# EAGLE design Airbeam v2.4 12-21-2017 (EAGLE 8.4.1)
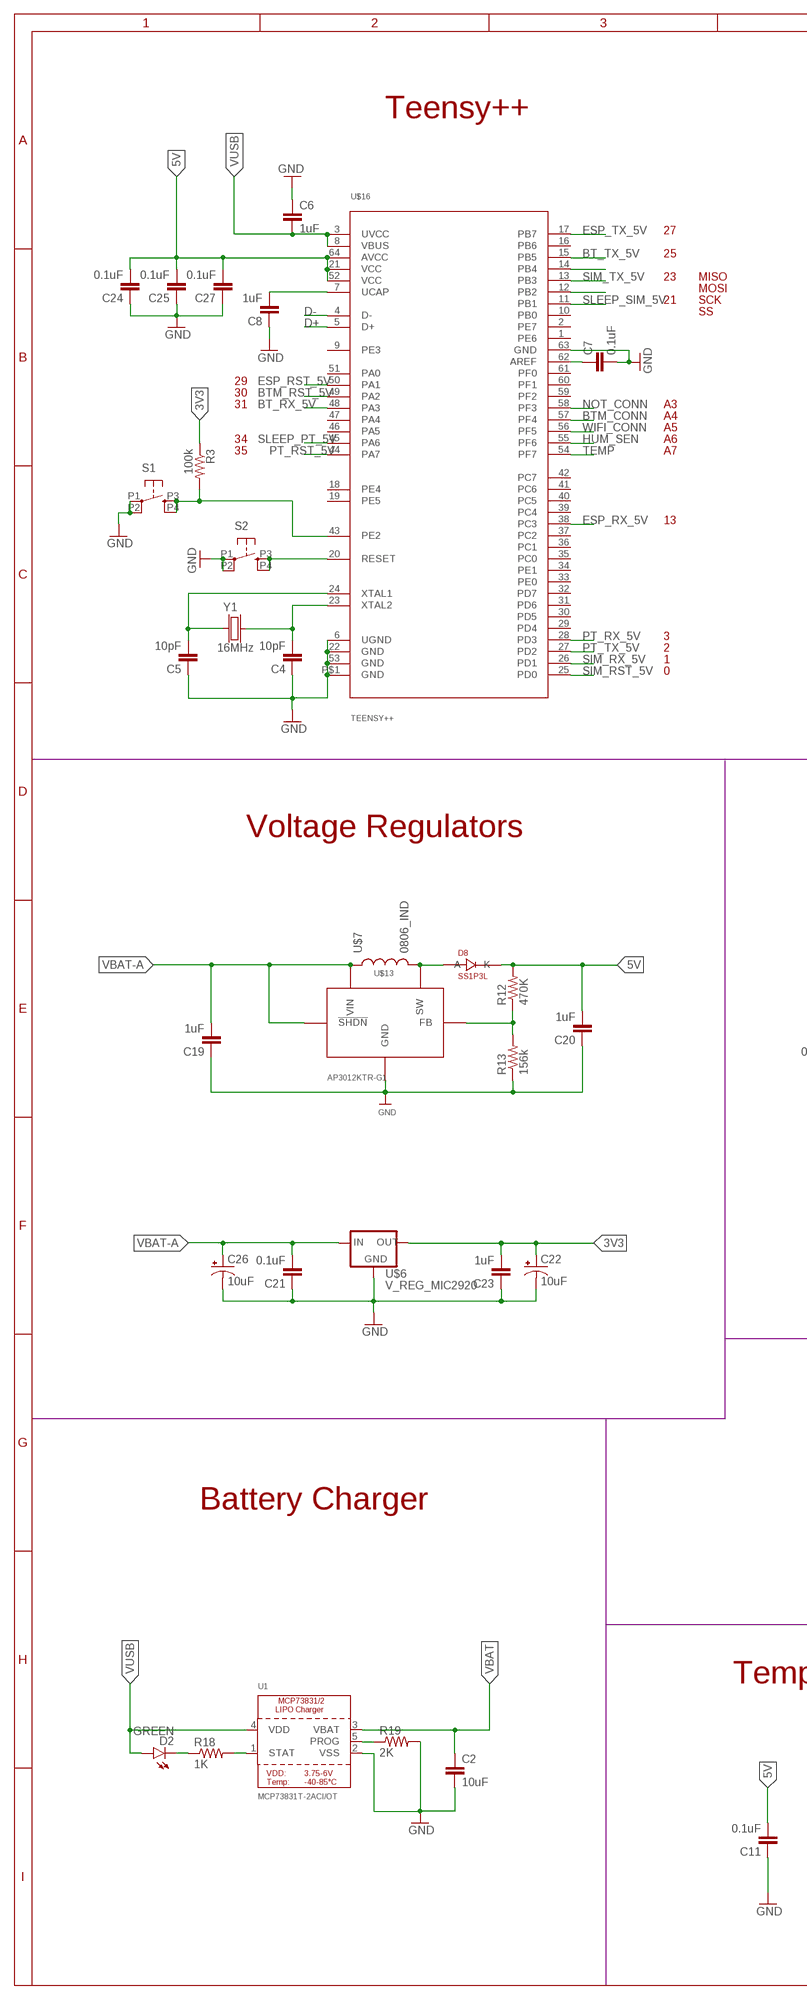
[diagram p0: schematic, sheet 1, part 1 of 2]
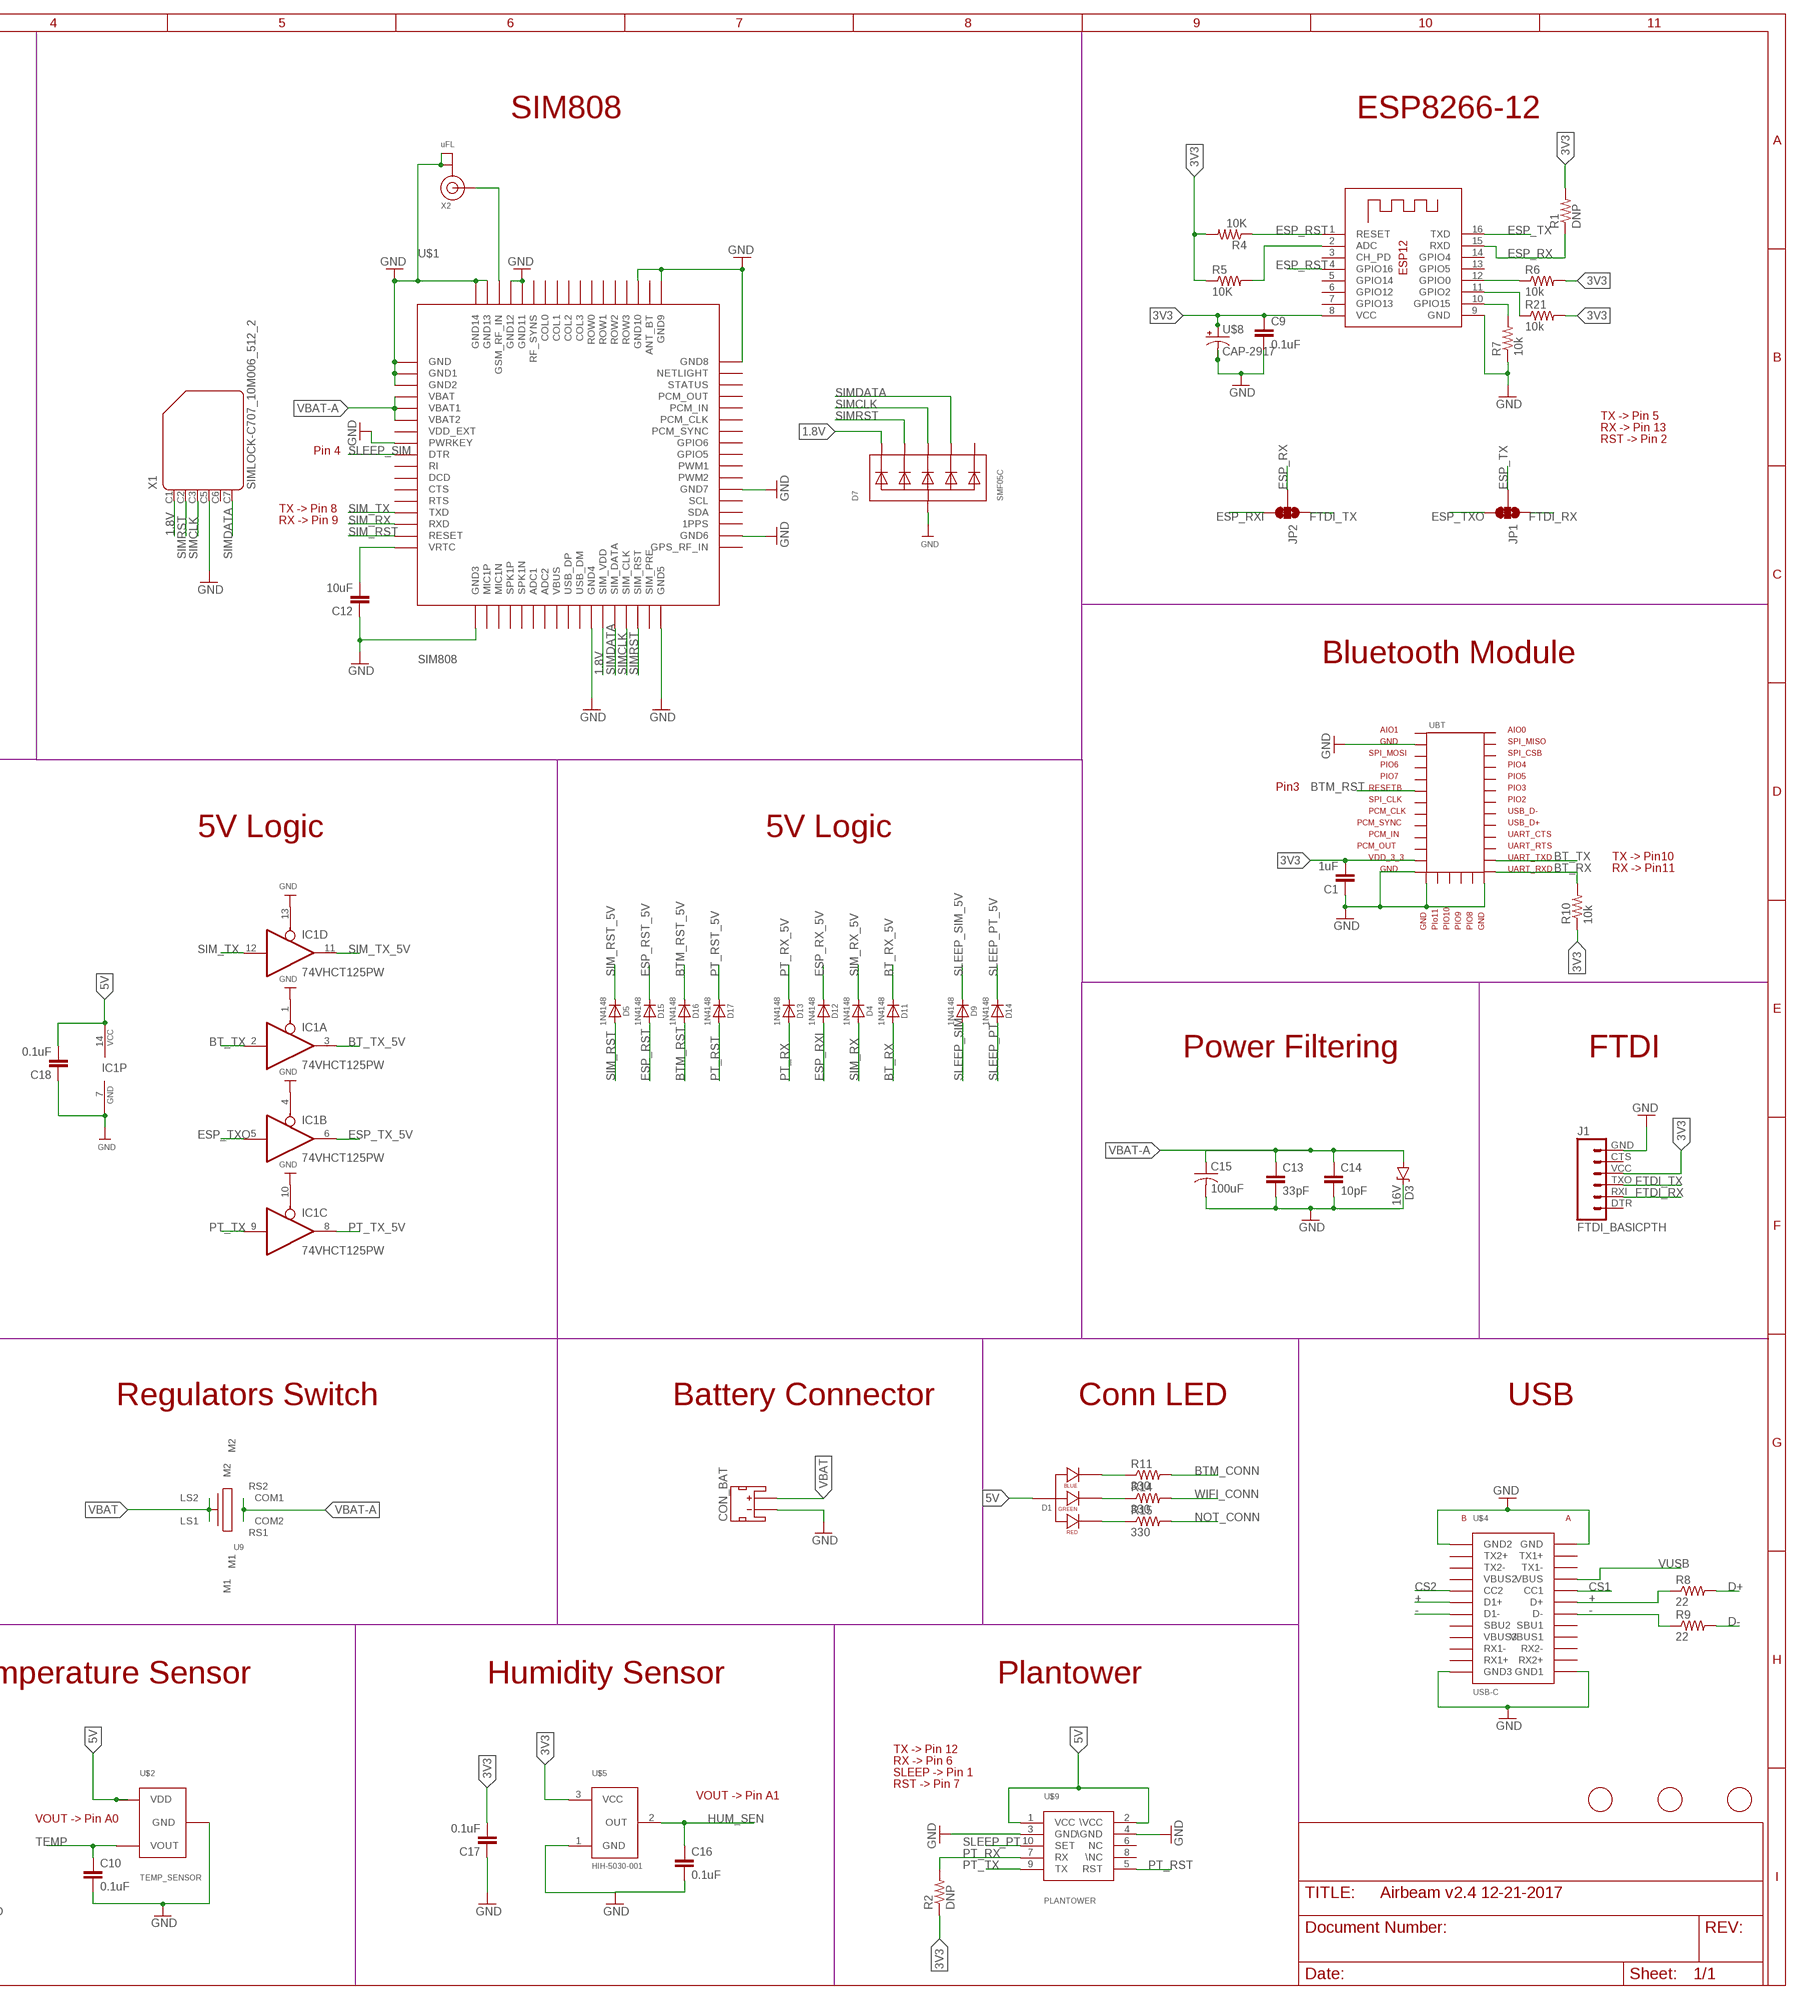
[diagram p1: schematic, sheet 1, part 2 of 2]

## Parts
C1  1uF  CAP-0603-1UF-25V-10%  [CAP0603]
C2  10uF  CAP-0603-10UF-10V-10%  [CAP0603]
C4  10pF  CAP-0603-20PF-50V-5%  [CAP0603]
C5  10pF  CAP-0603-20PF-50V-5%  [CAP0603]
C6  1uF  CAP-0603-1UF-16V-10%  [CAP0603]
C7  0.1uF  CAP-0603-0.1UF-10V-5%  [CAP0603]
C8  1uF  CAP-0603-1UF-16V-10%  [CAP0603]
C9  0.1uF  CAP-0603-0.1UF-10V-5%  [CAP0603]
C10  0.1uF  CAP-0603-0.1UF-10V-5%  [CAP0603]
C11  0.1uF  CAP-0603-0.1UF-10V-5%  [CAP0603]
C12  10uF  CAP-0603-10UF-10V-10%  [CAP0603]
C13  33pF  CAP-0603-EMPTY-VALUES  [CAP0603]
C14  10pF  CAP-0603-EMPTY-VALUES  [CAP0603]
C15  100uF  C-USC1210  [C1210]
C16  0.1uF  CAP-0603-0.1UF-10V-5%  [CAP0603]
C17  0.1uF  CAP-0603-0.1UF-10V-5%  [CAP0603]
C18  0.1uF  CAP-0603-0.1UF-10V-5%  [CAP0603]
C19  1uF  CAP-0603-1UF-16V-10%  [CAP0603]
C20  1uF  CAP-0603-1UF-16V-10%  [CAP0603]
C21  0.1uF  CAP-0603-0.1UF-10V-5%  [CAP0603]
C22  10uF  CAP_POL1206  [EIA3216]
C23  1uF  CAP-0603-1UF-16V-10%  [CAP0603]
C24  0.1uF  CAP-0603-0.1UF-10V-5%  [CAP0603]
C25  0.1uF  CAP-0603-0.1UF-10V-5%  [CAP0603]
C26  10uF  CAP_POL1206  [EIA3216]
C27  0.1uF  CAP-0603-0.1UF-10V-5%  [CAP0603]
CON_BAT  CON_BAT  JST_2MM_MALE  [JST-2-SMD]
D1  LED1615RGBC  [LED1615RGBC]
D2  GREEN  LED-GREEN-0603  [LED-0603]
D3  16V  DIODE-ZENER16V  [SOD-123]
D4  1N4148  DIODESOD-323  [SOD-323]
D5  1N4148  DIODESOD-323  [SOD-323]
D7  SMF05C  TVSARRAY_5LANE  [SOT363]
D8  SS1P3L  [DO220AAL]
D9  1N4148  DIODESOD-323  [SOD-323]
D11  1N4148  DIODESOD-323  [SOD-323]
D12  1N4148  DIODESOD-323  [SOD-323]
D13  1N4148  DIODESOD-323  [SOD-323]
D14  1N4148  DIODESOD-323  [SOD-323]
D15  1N4148  DIODESOD-323  [SOD-323]
D16  1N4148  DIODESOD-323  [SOD-323]
D17  1N4148  DIODESOD-323  [SOD-323]
IC1  74VHCT125PW  74ABT125PW  [TSSOP14]
J1  FTDI_BASICPTH  [FTDI_BASIC]
JP1  JUMPER-PAD-3-2OF3_NC_BY_TRACE_SMALL  [PAD-JUMPER-3-2OF3_NC_BY_TRACE_YES_SILK_FULL_BOX]
JP2  JUMPER-PAD-3-2OF3_NC_BY_TRACE_SMALL  [PAD-JUMPER-3-2OF3_NC_BY_TRACE_YES_SILK_FULL_BOX]
R1  DNP  RES-0603_EMPTY-FIELDS  [RES-0603]
R2  DNP  RES-0603_EMPTY-FIELDS  [RES-0603]
R3  100k  RES-0603_EMPTY-FIELDS  [RES-0603]
R4  10K  RES-0603-10K-5%  [RES-0603]
R5  10K  RES-0603-10K-5%  [RES-0603]
R6  10k  RES-0603_EMPTY-FIELDS  [RES-0603]
R7  10k  RES-0603_EMPTY-FIELDS  [RES-0603]
R8  22  RES-0603-22-5%  [RES-0603]
R9  22  RES-0603-22-5%  [RES-0603]
R10  10k  RES-0603_EMPTY-FIELDS  [RES-0603]
R11  330  RES-0603-22-5%  [RES-0603]
R12  470K  RES-0603-470K-5%  [RES-0603]
R13  156k  RES-0603_EMPTY-FIELDS  [RES-0603]
R14  330  RES-0603-22-5%  [RES-0603]
R15  330  RES-0603-22-5%  [RES-0603]
R18  1K  RES-0603-1K-5%  [RES-0603]
R19  2K  RES-0603-2K-1%  [RES-0603]
R21  10k  RES-0603_EMPTY-FIELDS  [RES-0603]
S1  JAYCONSYSTEMS_TAC_SWITCHHIRO  [JAYCONSYSTEMS_TS-1184]
S2  JAYCONSYSTEMS_TAC_SWITCHHIRO  [JAYCONSYSTEMS_TS-1184]
U1  MCP73831T-2ACI/OT  MCP73831/2  [SOT23-5]
U9  PUSHBUTTON  [PUSHBUTTON]
U$1  SIM808  [SIM808]
U$2  TEMP_SENSOR  [SOT23-3]
U$3  FIDUCIAL  [FIDUCIAL_1MM]
U$4  USB-C  [USB-C]
U$5  HIH-5030-001  [HUM_SEN]
U$6  V_REG_MIC2920  [SOT223]
U$7  0806_IND  [0806]
U$8  CAP-2917  [EIA2917]
U$9  PLANTOWER  [CONN]
U$12  FIDUCIAL  [FIDUCIAL_1MM]
U$13  AP3012KTR-G1  [SOT23-5]
U$14  FIDUCIAL  [FIDUCIAL_1MM]
U$16  TEENSY++  [64QFN]
UBT  BT-NVC-MDCS42A  [BT_NVC-MDCS42A]
X1  SIMLOCK-C707_10M006_512_2  [C707_10M006_512_2]
X2  uFL  ANTENNA_U.FL  [U.FL]
X3  ESP-12  [ESP-12]
Y1  16MHz  OSCILLATOR  [CRYSTAL-3.2X2.5]

## Nets
1.8V: D7.1(C1) U$1.29(SIM_VDD) X1.C1
3V3: C1.2 C9.1 C17.2 C22.A(+) C23.2 J1.VCC R1.2 R2.1 R3.1 R4.2 R5.1 R6.2 R10.1 R21.2 U$5.3(VCC) U$6.3(OUT) U$8.1(+) UBT.P$12 X3.8(VCC)
5V: C11.2 C18.2 C20.2 C24.2 C25.2 C27.2 D1.1(ANODE) D8.P$1(K) IC1.14(P:VCC) R12.2 U$2.1(VDD) U$9.1(VCC) U$9.2(\VCC) U$16.21(VCC) U$16.52(VCC) U$16.64(AVCC)
+: R8.1 U$4.A6(D+) U$4.B6(D1+)
-: R9.1 U$4.A7(D-) U$4.B7(D1-)
BT_RX: D11.A R10.2 UBT.P$20
BT_RX_5V: D11.C U$16.48(PA3)
BT_TX: IC1.2(A:I) UBT.P$21
BT_TX_5V: IC1.3(A:O) U$16.15(PB5)
BTM_CONN: R11.2 U$16.57(PF4)
BTM_RST: D16.A UBT.P$6
BTM_RST_5V: D16.C U$16.49(PA2)
CS1: U$4.A5(CC1)
CS2: U$4.B5(CC2)
D+: R8.2 U$16.5(D+)
D-: R9.2 U$16.4(D-)
ESP_RST: D15.A R4.1 X3.1(RESET) X3.4(GPIO16)
ESP_RST_5V: D15.C U$16.50(PA1)
ESP_RX: JP2.2 R1.1 X3.15(RXD)
ESP_RX_5V: D12.C U$16.38(PC3)
ESP_RXI: D12.A JP2.3
ESP_TX: JP1.2 X3.16(TXD)
ESP_TX_5V: IC1.6(B:O) U$16.17(PB7)
ESP_TXO: IC1.5(B:I) JP1.3
FTDI_RX: J1.RXI JP1.1
FTDI_TX: J1.TXO JP2.1
GND: C1.1 C2.2 C4.1 C5.1 C6.1 C7.2 C8.1 C9.2 C10.2 C11.1 C12.1 C13.2 C14.2 C15.2 C16.2 C17.1 C18.1 C19.1 C20.1 C21.1 C22.C(-) C23.1 C24.1 C25.1 C26.C(-) C27.1 CON_BAT.1(-) D3.C D7.2(A) IC1.1(A:OE) IC1.4(B:OE) IC1.7(P:GND) IC1.10(C:OE) IC1.13(D:OE) J1.GND R7.1 R13.1 R19.2 S1.P1 S1.P2 S2.P1 S2.P2 U1.2(VSS) U$1.1(GND) U$1.2(GND1) U$1.3(GND2) U$1.8(PWRKEY) U$1.18(GND3) U$1.28(GND4) U$1.34(GND5) U$1.36(GND6) U$1.40(GND7) U$1.51(GND8) U$1.52(GND9) U$1.54(GND10) U$1.64(GND11) U$1.65(GND12) U$1.67(GND13) U$1.68(GND14) U$2.3(GND) U$4.A1(GND) U$4.A12(GND1) U$4.B1(GND2) U$4.B12(GND3) U$5.1(GND) U$6.2(GND) U$6.4(GND) U$8.2(-) U$9.3(GND) U$9.4(\GND) U$13.2(GND) U$16.6(UGND) U$16.22(GND) U$16.53(GND) U$16.63(GND) U$16.P$1(GND) UBT.P$2 UBT.P$13 UBT.P$14 UBT.P$19 X1.C5 X2.1(GND) X2.2(GND) X3.9(GND)
HUM_SEN: C16.1 U$5.2(OUT) U$16.55(PF6)
N$1: R5.2 X3.2(ADC)
N$2: S2.P3 S2.P4 U$16.20(RESET)
N$3: C8.2 U$16.7(UCAP)
N$4: C7.1 U$16.62(AREF)
N$5: U$16.12(PB2)
N$6: D2.C R18.1
N$7: R21.1 X3.11(GPIO2)
N$8: R18.2 U1.1(STAT)
N$10: U$16.14(PB4)
N$11: R3.2 S1.P3 S1.P4 U$16.43(PE2)
N$12: R7.2 X3.10(GPIO15)
N$13: D1.4(BLUE_CATHODE) R11.1
N$14: U$1.66(GSM_RF_IN) X2.3(SIGNAL)
N$15: C12.2 U$1.17(VRTC)
N$16: D1.3(GREEN_CATHODE) R14.1
N$17: R12.1 R13.2 U$13.3(FB)
N$18: R19.1 U1.5(PROG)
N$20: R6.1 X3.12(GPIO0)
N$23: D1.2(RED_CATHODE) R15.1
N$24: D8.P$2(A) U$7.2 U$13.1(SW)
N$26: C5.2 U$16.24(XTAL1) Y1.1
N$27: C4.2 U$16.23(XTAL2) Y1.3
NOT_CONN: R15.2 U$16.58(PF3)
PT_RST: D17.A U$9.5(RST)
PT_RST_5V: D17.C U$16.44(PA7)
PT_RX: D13.A R2.2 U$9.7(RX)
PT_RX_5V: D13.C U$16.28(PD3)
PT_TX: IC1.9(C:I) U$9.9(TX)
PT_TX_5V: IC1.8(C:O) U$16.27(PD2)
SIM_RST: D5.A U$1.16(RESET)
SIM_RST_5V: D5.C U$16.25(PD0)
SIM_RX: D4.A U$1.15(RXD)
SIM_RX_5V: D4.C U$16.26(PD1)
SIM_TX: IC1.12(D:I) U$1.14(TXD)
SIM_TX_5V: IC1.11(D:O) U$16.13(PB3)
SIMCLK: D7.4(C3) U$1.31(SIM_CLK) X1.C3
SIMDATA: D7.5(C4) U$1.30(SIM_DATA) X1.C7
SIMRST: D7.3(C2) U$1.32(SIM_RST) X1.C2
SLEEP_PT: D14.A U$9.10(SET)
SLEEP_PT_5V: D14.C U$16.45(PA6)
SLEEP_SIM: D9.A U$1.9(DTR)
SLEEP_SIM_5V: D9.C U$16.11(PB1)
TEMP: C10.1 U$2.2(VOUT) U$16.54(PF7)
VBAT: C2.1 CON_BAT.2(+) U1.3(VBAT) U9.LS1 U9.LS2
VBAT-A: C13.1 C14.1 C15.1 C19.2 C21.2 C26.A(+) D3.A U9.C1(COM1) U9.C2(COM2) U$1.4(VBAT) U$1.5(VBAT1) U$1.6(VBAT2) U$6.1(IN) U$7.1 U$13.4(!SHDN) U$13.5(VIN)
VUSB: C6.2 D2.A U1.4(VDD) U$4.A4(VBUS) U$16.3(UVCC) U$16.8(VBUS)
WIFI_CONN: R14.2 U$16.56(PF5)
Unconnected: CON_BAT.NC1(PAD1) CON_BAT.NC2(PAD2) D7.6(C5) J1.CTS J1.DTR U9.M1 U9.M2 U9.RS1 U9.RS2 U$1.7(VDD_EXT) U$1.10(RI) U$1.11(DCD) U$1.12(CTS) U$1.13(RTS) U$1.19(MIC1P) U$1.20(MIC1N) U$1.21(SPK1P) U$1.22(SPK1N) U$1.23(ADC1) U$1.24(ADC2) U$1.25(VBUS) U$1.26(USB_DP) U$1.27(USB_DM) U$1.33(SIM_PRE) U$1.35(GPS_RF_IN) U$1.37(1PPS) U$1.38(SDA) U$1.39(SCL) U$1.41(PWM2) U$1.42(PWM1) U$1.43(GPIO5) U$1.44(GPIO6) U$1.45(PCM_SYNC) U$1.46(PCM_CLK) U$1.47(PCM_IN) U$1.48(PCM_OUT) U$1.49(STATUS) U$1.50(NETLIGHT) U$1.53(ANT_BT) U$1.55(ROW3) U$1.56(ROW2) U$1.57(ROW1) U$1.58(ROW0) U$1.59(COL3) U$1.60(COL2) U$1.61(COL1) U$1.62(COL0) U$1.63(RF_SYNS) U$4.A2(TX1+) U$4.A3(TX1-) U$4.A8(SBU1) U$4.A9(VBUS1) U$4.A10(RX2-) U$4.A11(RX2+) U$4.B2(TX2+) U$4.B3(TX2-) U$4.B4(VBUS2) U$4.B8(SBU2) U$4.B9(VBUS3) U$4.B10(RX1-) U$4.B11(RX1+) U$9.6(NC) U$9.8(\NC) U$16.1(PE6) U$16.2(PE7) U$16.9(PE3) U$16.10(PB0) U$16.16(PB6) U$16.18(PE4) U$16.19(PE5) U$16.29(PD4) U$16.30(PD5) U$16.31(PD6) U$16.32(PD7) U$16.33(PE0) U$16.34(PE1) U$16.35(PC0) U$16.36(PC1) U$16.37(PC2) U$16.39(PC4) U$16.40(PC5) U$16.41(PC6) U$16.42(PC7) U$16.46(PA5) U$16.47(PA4) U$16.51(PA0) U$16.59(PF2) U$16.60(PF1) U$16.61(PF0) UBT.P$1 UBT.P$3 UBT.P$4 UBT.P$5 UBT.P$7 UBT.P$8 UBT.P$9 UBT.P$10 UBT.P$11 UBT.P$15 UBT.P$16 UBT.P$17 UBT.P$18 UBT.P$22 UBT.P$23 UBT.P$24 UBT.P$25 UBT.P$26 UBT.P$27 UBT.P$28 UBT.P$29 UBT.P$30 UBT.P$31 UBT.P$32 X1.C6 X3.3(CH_PD) X3.5(GPIO14) X3.6(GPIO12) X3.7(GPIO13) X3.13(GPIO5) X3.14(GPIO4)

## Notes on the sheet
- Teensy++ | SIM808 | ESP8266-12
- 27
- 25
- 23 | MISO
- MOSI
- 21 | SCK
- SS
- 29
- 30
- 31 | A3
- A4 | TX -> Pin 5
- A5 | RX -> Pin 13
- 34 | A6 | RST -> Pin 2
- 35 | A7 | Pin 4
- TX -> Pin 8
- 13 | RX -> Pin 9
- 3
- 2
- 1 | Bluetooth Module
- 0
- Pin3
- Voltage Regulators | 5V Logic | 5V Logic
- TX -> Pin10
- RX -> Pin11
- Power Filtering | FTDI
- Regulators Switch | Battery Connector | Conn LED | USB
- Battery Charger
- Temperature Sensor | Humidity Sensor | Plantower
- TX -> Pin 12
- RX -> Pin 6
- SLEEP -> Pin 1
- RST -> Pin 7
- VOUT -> Pin A1
- VOUT -> Pin A0

## Library data of the parts
C1 = Jaycon OPL Capacitors:CAP-0603: Jaycon Systems OPL Capacitors 0603 Package. The name for the part has the Value - Voltage - Tolerance making part selection simple.; JAYCON: CP-0024; MFG#1: CL10A105KA8NNNC; SIZE: 0603; TEMPERATURE-COEFFICIENT: X5R; TOLERANCE: 10%; VOLTAGE: 25V
C2 C12 = Jaycon OPL Capacitors:CAP-0603: Jaycon Systems OPL Capacitors 0603 Package. The name for the part has the Value - Voltage - Tolerance making part selection simple.; JAYCON: CP-0070; MFG#1: GRM188R61A106KE69D; SIZE: 0603; TEMPERATURE-COEFFICIENT: X5R; TOLERANCE: 10%; VOLTAGE: 10V
C4 C5 = Jaycon OPL Capacitors:CAP-0603: Jaycon Systems OPL Capacitors 0603 Package. The name for the part has the Value - Voltage - Tolerance making part selection simple.; JAYCON: CP-0033; MFG#1: CL10C200JB8NNNC; SIZE: 0603; TEMPERATURE-COEFFICIENT: NP0; TOLERANCE: 5%; VALUE: 20pF; VOLTAGE: 50V
C6 C8 C19 C20 C23 = Jaycon OPL Capacitors:CAP-0603: Jaycon Systems OPL Capacitors 0603 Package. The name for the part has the Value - Voltage - Tolerance making part selection simple.; JAYCON: CP-0065; MFG#1: C1608X5R1C105KT; SIZE: 0603; TEMPERATURE-COEFFICIENT: X5R; TOLERANCE: 10%; VOLTAGE: 16V
C7 C9-C11 C16-C18 C21 C24 C25 C27 = Jaycon OPL Capacitors:CAP-0603: Jaycon Systems OPL Capacitors 0603 Package. The name for the part has the Value - Voltage - Tolerance making part selection simple.; JAYCON: CP-0047; MFG#1: VJ0603Y104JXQPW1BC; SIZE: 0603; TEMPERATURE-COEFFICIENT: X7R; TOLERANCE: 5%; VOLTAGE: 10V
C13 C14 = Jaycon OPL Capacitors:CAP-0603: Jaycon Systems OPL Capacitors 0603 Package. The name for the part has the Value - Voltage - Tolerance making part selection simple.; SIZE: 0603
C15 = rcl:C-US: CAPACITOR, American symbol
C22 C26 = SparkFun-Passives:CAP_POL: Capacitor Polarized These are standard SMD and PTH capacitors. Normally 10uF, 47uF, and 100uF in electrolytic and tantalum varieties. Always verify the external diameter of the through hole cap, it varies with capacity, voltage, and manufacturer. The EIA devices should be standard.
CON_BAT = SparkFun-Connectors:JST_2MM_MALE: Mates to single-cell LiPo batteries. CONN-11443 Now with smashable polarity marks!; BTM_NEG: -; BTM_POS: +; PARTNO: S2B-PH-SM4-TB(LF)(SN); PROD_ID: CONN-11443; TOP_NEG: -; TOP_POS: +
D1 = Jaycon Systems:LED1615RGBC
D2 = Jaycon OPL LED:LED-GREEN: Green LED's; FORWARD-VOLTAGE: 3.2V; JAYCON: DI-0048; LITE-ON-MFG: LTST-C191TGKT; MOUNT: SMT; SIZE: 0603
D3 = SparkFun-DiscreteSemi:DIODE-ZENER: Zener Diode Production Part - 8199 3.4V Zener Voltage; PROD_ID: DIO-12440
D4 D5 D9 D11-D17 = microbuilder:DIODE: Diode SMA Model Volts Amps Type Vf Ir Digikey # Notes SSA34-E3 40V 3A Schottky 480mV @ 3A 200uA @ 40V SSA34-E3/61TGITR-ND CDBA120-G 20V 1A Schottky 500mV @ 1A 500uA @ 20V 641-1014-6-ND REEL MBRA210 10V 2A Schottky 350mV @ 2A 700uA @ 10V MBRA210LT3 SOD-123 Model Volts Amps Type Vf Ir Order # Notes BAT54T1G 30V 200mA Schottky 800mV @ 200mA 2uA @ 25V BAT54T1GOSTR-ND B0530W 30V 500mA Schottky 430mV @ 500mA 130uA @ 30V B0530W-FDICT-ND REEL MBR120 20V 1A Schottky 340mV @ 1A MBR120VLSFT1GOSCT-ND SOD-323 Model Volts Amps Type Vf Ir Order # Notes PMEG2005EJ 20V 500mA Schottky 355mV @ 500mA 568-4110-1-ND ZLLS410 10V 570mA Schottky 380mV @ 570mA ZLLS410CT-ND 1N4148WS 75V 150mA Silicon/Simple 1V 1N4148WSFSCT-ND REEL SOD-523 Model Volts Amps Type Vf Ir Order # Notes BAT54XV2 30V 200mA Schottky 0.8V @ 100mA BAT54XV2CT-ND TB751S 30V 30mA Schottky RB751S-40TE61CT-ND SOT23-R/W (R = Solder Paste/Reflow Ovens, W = Hand-Soldering) Model Volts Amps Type Vf Ir Order # Notes BAT54FILM 40V 300mA Schottky 497-7162-1-ND POWERDI-5 Model Volts Amps Type Vf Ir Order # Notes PDS560 60V 5A Schottky 670mV @ 5A 150uA @ 60V PDS560DICT-ND
D7 = microbuilder:TVSARRAY_5LANE: Voltage Transient Suppressor Array SOT363 SMF05C - 100W 5V: Digikey - SMF05CT1GOSCT-ND
D8 = SmartPrj:SS1P3L; OC_NEWARK: unknown
IC1 = 74xx-us:74*125: Quad bus BUFFER, 3-state
J1 = SparkFun-Connectors:FTDI_BASIC: FTDI Basic header with labels
JP1 JP2 = SparkFun-Passives:JUMPER-PAD-3-2OF3_NC_BY_TRACE
R1-R3 R6 R7 R10 R13 R21 = Jaycon OPL Resistors:RES-0603: SMD 0603 Resistor Library; SIZE: 0603; WATTAGE: 0.1W
R4 R5 = Jaycon OPL Resistors:RES-0603: SMD 0603 Resistor Library; JAYCON: RS-0027; ROHM-MFG: MCR03EZPJ103; SAMSUNG-MFG: RC1608J103CS; SIZE: 0603; TOLERANCE: 5%; VISHAY-MFG: CRCW060310K0JNEA; WATTAGE: 0.1W; YAGEO-MFG: RC0603JR-0710KP
R8 R9 = Jaycon OPL Resistors:RES-0603: SMD 0603 Resistor Library; JAYCON: RS-0044; SIZE: 0603; TOLERANCE: 5%; WATTAGE: 0.1W; YAGEO-MFG: RC0603JR-0722RL
R11 R14 R15 = Jaycon OPL Resistors:RES-0603: SMD 0603 Resistor Library; JAYCON: RS-0044; SIZE: 0603; TOLERANCE: 5%; VALUE: 22; WATTAGE: 0.1W; YAGEO-MFG: RC0603JR-0722RL
R12 = Jaycon OPL Resistors:RES-0603: SMD 0603 Resistor Library; JAYCON: RS-0072; SIZE: 0603; TOLERANCE: 5%; WATTAGE: 0.1W; YAGEO-MFG: RC0603JR-07470KL
R18 = Jaycon OPL Resistors:RES-0603: SMD 0603 Resistor Library; JAYCON: RS-0026; SAMSUNG-MFG: RC1608J102CS; SIZE: 0603; TOLERANCE: 5%; VISHAY-MFG: CRCW06031K00JNEA; WATTAGE: 0.1W; YAGEO-MFG: RC0603JR-071KP
R19 = Jaycon OPL Resistors:RES-0603: SMD 0603 Resistor Library; JAYCON: RS-0017; SIZE: 0603; TOLERANCE: 1%; WATTAGE: 0.1W; YAGEO-MFG: RC0603FR-072KL
S1 S2 = NRF8002_breakout_board_-_v1:JAYCONSYSTEMS_TAC_SWITCH: Momentary Switch Button commonly used for reset or general input. Spark Fun Electronics SKU : COM-00097
U1 = microbuilder:MCP73831/2: MCP73831/2 LIPO Charger VDD: 3.75 - 6V Temp -40 - 85°C Programmable Charge Rate: 15-500mA NOTE: STAT is a tri-state logic output on the MCP73831 and an open-drain output on the MCP73832. SOT23-5 with 4.2V output and tri-state logic on STAT = MCP73831T-2ACI/OT
U9 = Airbeam:PUSHBUTTON; PARTNO: LC2259EENP
U$1 = Cellular:SIM808
U$2 = WingBug:TEMP_SENSOR
U$3 U$12 U$14 = adafruit:FIDUCIAL: For use by pick and place machines to calibrate the vision/machine, 1mm By microbuilder.eu
U$4 = Airbeam:USB-C
U$5 = Airbeam:HIH-5030-001
U$6 = JAYCONSYSTEMS:V_REG_MIC2920: MIC2920A (http://www.micrel.com/_PDF/mic2920.pdf) - 400mA output LDO Regulator
U$7 = Airbeam:0806_IND
U$8 = WiFiButton:CAP-2917
U$9 = Airbeam:PLANTOWER
U$13 = KineticHoop:AP3012KTR-G1
U$16 = Airbeam:TEENSY++
UBT = Airbeam:BT-NVC-MDCS42A; PARTNO: NVC-MDCS42A
X1 = con-amphenol:SIMLOCK-C707_10M006_512_2: C707A SIMLOCK® 2.5 mm with wide solder tails Source: Data sheet <http://www.amphenol.info/downloads/C707_10M006_512_2.pdf>; OC_FARNELL: unknown; OC_NEWARK: unknown
X2 = microbuilder:ANTENNA_U.FL: U.FL Antenna Connector
X3 = adafruit:ESP-12
Y1 = JAYCONSYSTEMS:OSCILLATOR: Crystal oscillator

## Net classes
2 gnd: width 0.152 mm, drill 0.33 mm, clearance 0.152 mm

## Board
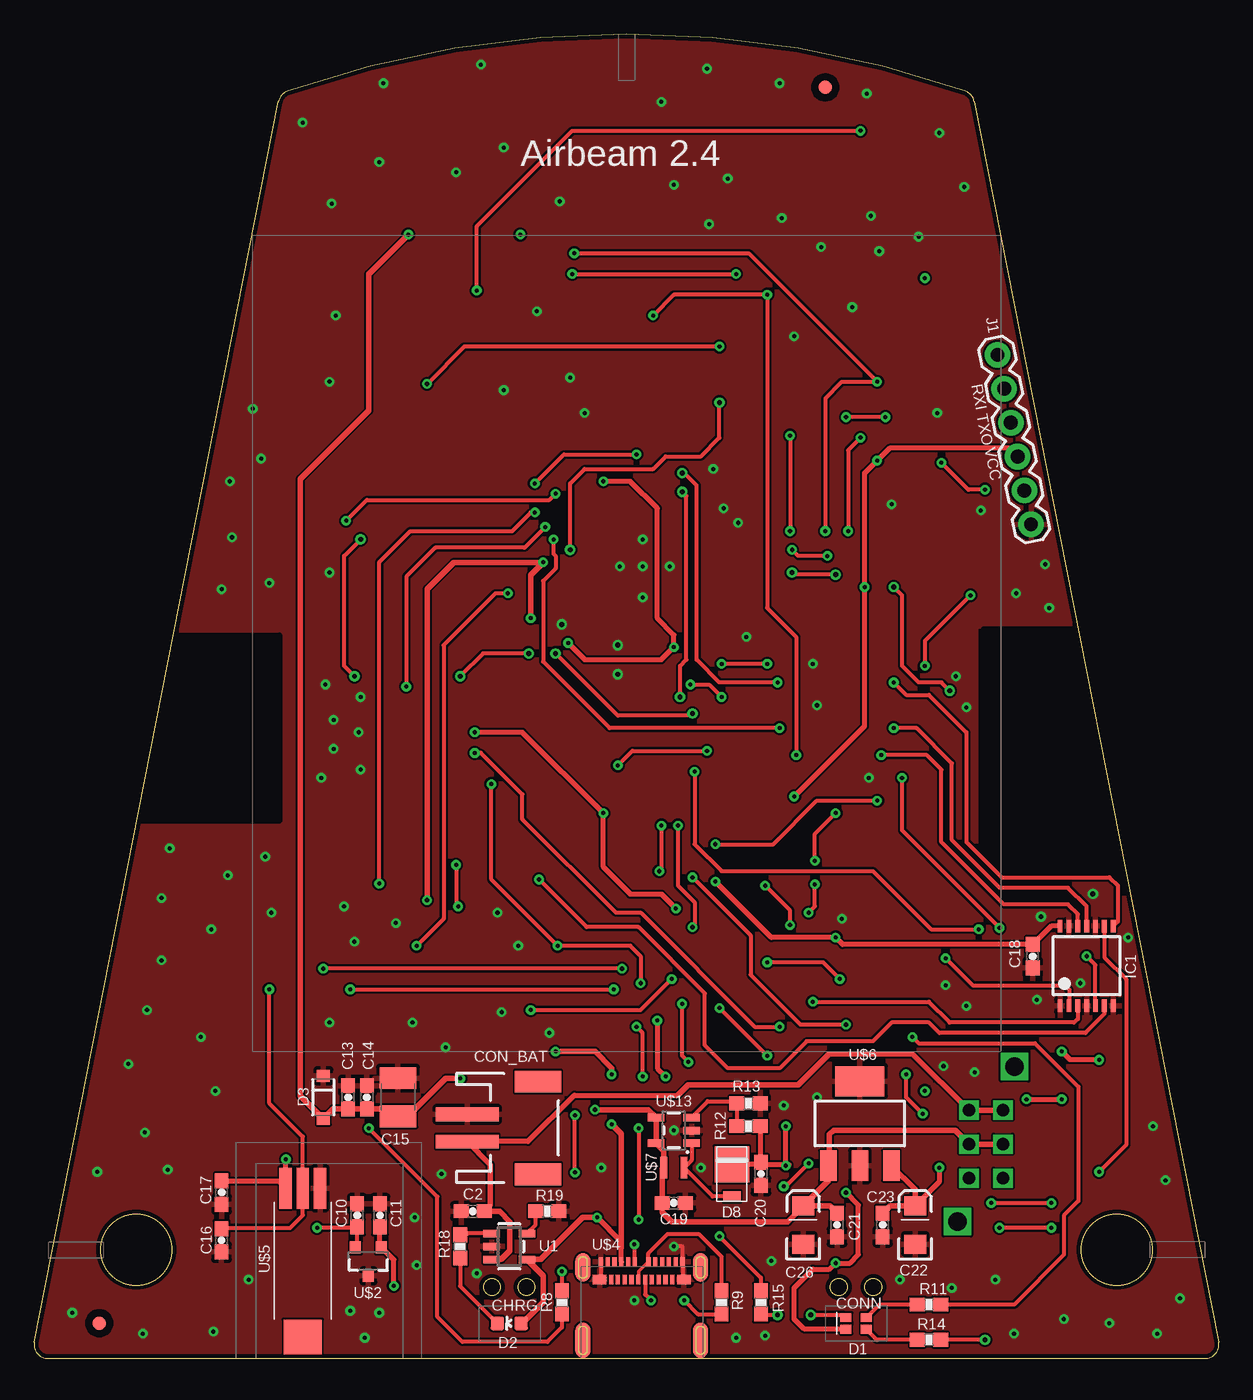
[diagram p2: board, top side]
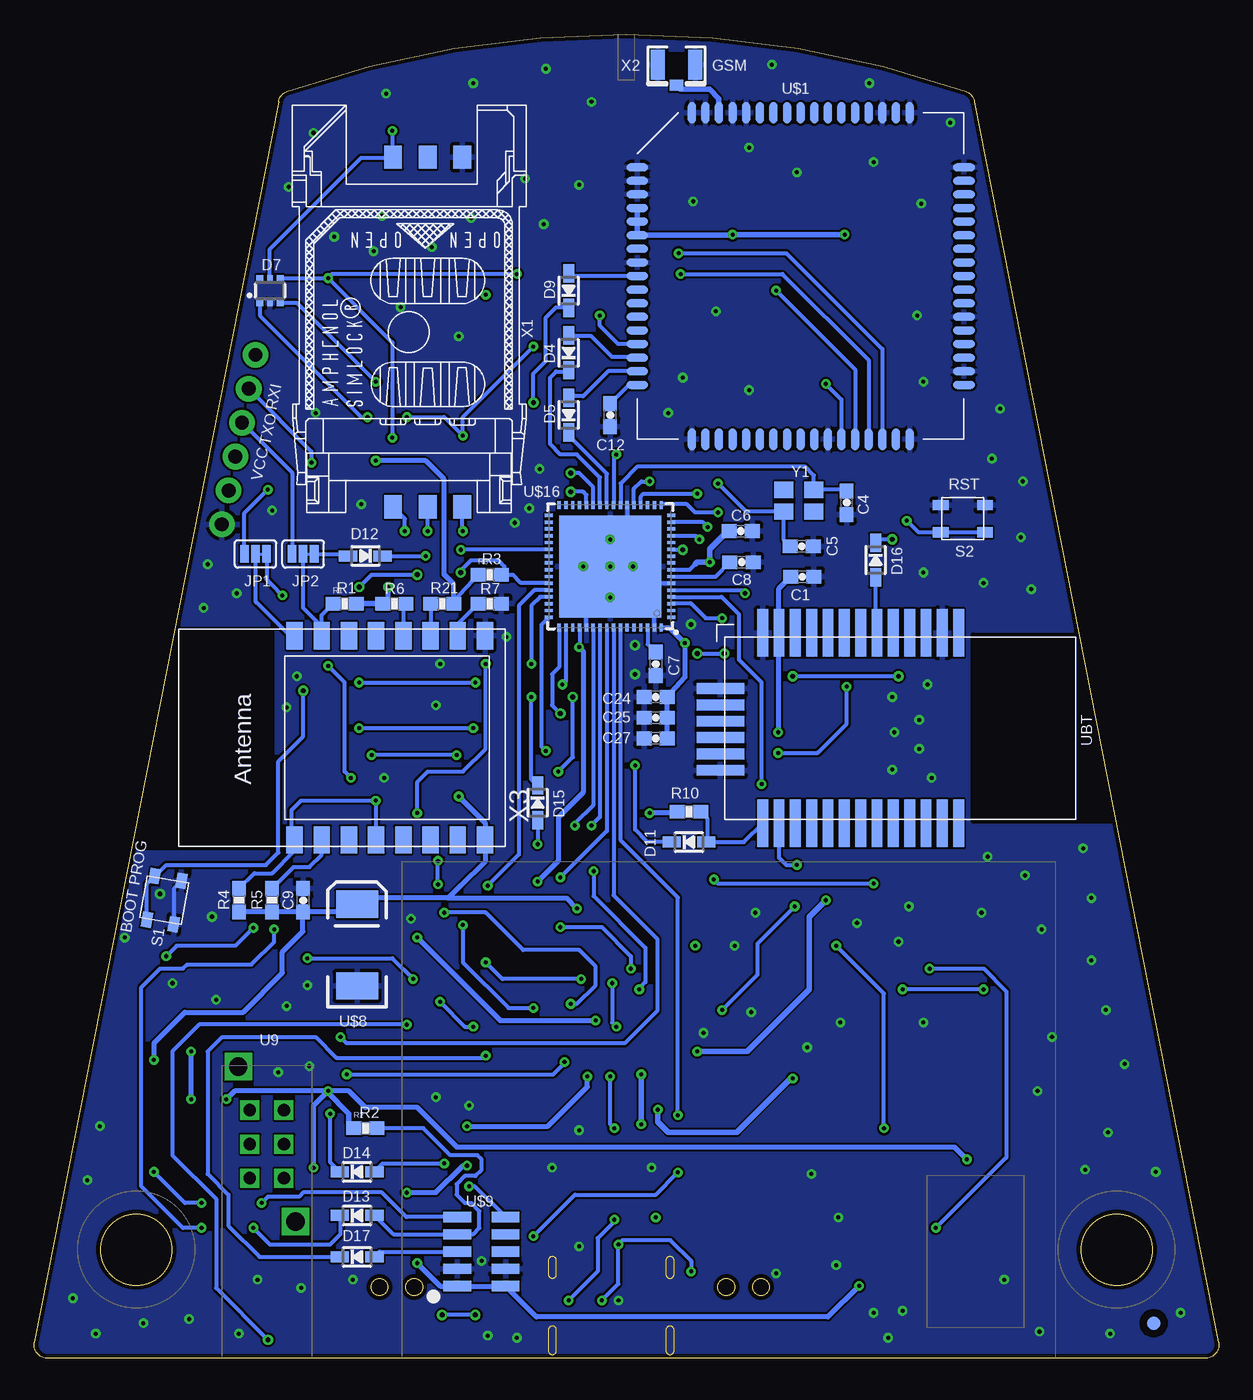
[diagram p3: board, bottom side, seen from below]

Size 87.05 x 97.34 mm. Coordinates in mm from the lower left corner, seen from the top.
Outline: 87.04,1.19 69.08,92.38 arc59 68.44,93.13
Outline: 17.95,92.38 0.02,1.19 arc102 1.01,0.01
Outline: 1.01,0 86.05,0 arc101 87.03,1.19
Outline: 17.96,92.38 arc-60 18.61,93.14 arc-38 68.45,93.14
Outline: circle at 33.65,5.26 radius 0.62
Outline: circle at 36.19,5.26 radius 0.62
Outline: circle at 59.12,5.26 radius 0.62
Outline: circle at 61.66,5.26 radius 0.62
Outline: circle at 79.55,8 radius 2.62
Outline: circle at 7.51,8 radius 2.62
Copper layers (1*16): Top 0.035mm / dielectric 1.5mm / Bottom 0.035mm
Design rules "default *": minimum track width 6mil, minimum drill 0.3mm, track to track 6mil, track to pad 6mil, pad to pad 6mil, via to via 6mil, smd to smd 6mil, copper to edge 12mil, drill to drill 8mil, minimum pad ring 10mil, minimum via ring 8mil, stop-mask expansion 4mil, vias tented up to drill 0.5mm, thermal gap 10mil

### Footprints (pad centres in the part's own frame; a part is rotated, then mirrored left to right if it is on the bottom)
CAP0603 = smd 1.1 x 1: 1 -0.85,0; 2 0.85,0
C1210 = smd 1.6 x 2.7: 1 -1.4,0; 2 1.4,0
EIA3216 = smd 1.4 x 1.6: A 1.4,0; C -1.4,0
JST-2-SMD = smd 1 x 4.6: 1 -1,-3.7; 2 1,-3.7 | smd 1.6 x 3.4: NC1 -3.4,1.5; NC2 3.4,1.5
LED1615RGBC = smd 0.8 x 0.65: 1 -0.75,-0.425; 2 -0.75,0.425; 3 0.75,-0.425; 4 0.75,0.425
LED-0603 = smd 1 x 1: A 0,-0.877; C 0,0.877
SOD-123 = smd 0.9 x 0.95: A 1.575,0; C -1.575,0
SOD-323 = smd 1.35 x 0.8: A 1.27,0; C -1.27,0
SOT363 = smd 0.5 x 0.5: 1 -0.75,-0.9; 3 0.75,-0.9; 4 0.75,0.9; 6 -0.75,0.9 | smd 0.4 x 0.5: 2 0,-0.9; 5 0,0.9
DO220AAL = smd 2.667 x 2.54: P$1 -0.7,0 | smd 0.762 x 1.27: P$2 1.65,0
TSSOP14 = smd 0.35 x 0.9: 1 -1.95,-2.925; 2 -1.3,-2.925; 3 -0.65,-2.925; 4 0,-2.925; 5 0.65,-2.925; 6 1.3,-2.925; 7 1.95,-2.925; 8 1.95,2.925; 9 1.3,2.925; 10 0.65,2.925; 11 0,2.925; 12 -0.65,2.925; 13 -1.3,2.925; 14 -1.95,2.925
FTDI_BASIC = drill 1.016 pad 1.88: CTS 10.16,0; DTR 0,0; GND 12.7,0; RXI 2.54,0; TXO 5.08,0; VCC 7.62,0
PAD-JUMPER-3-2OF3_NC_BY_TRACE_YES_SILK_FULL_BOX = smd 0.635 x 1.27: 1 -0.813,0; 2 0,0; 3 0.813,0
RES-0603 = smd 1.1 x 1: 1 -0.85,0; 2 0.85,0
JAYCONSYSTEMS_TS-1184 = smd 1.15 x 0.75: P1 -1.625,1; P2 1.625,1; P3 -1.625,-1; P4 1.625,-1
SOT23-5 = smd 0.55 x 1.2: 1 -0.95,-1.3; 2 0,-1.3; 3 0.95,-1.3; 4 0.95,1.3; 5 -0.95,1.3
PUSHBUTTON = drill 0.9 square: C1 0,1.25; C2 0,-1.25; LS1 -2.5,1.25; LS2 -2.5,-1.25; RS1 2.5,1.25; RS2 2.5,-1.25 | drill 1.35 square: M1 -5.7,-2.1; M2 5.7,2.1
SIM808 = smd 1.6 x 0.6: 1 -12,8; 2 -12,7; 3 -12,6; 4 -12,5; 5 -12,4; 6 -12,3; 7 -12,2; 8 -12,1; 9 -12,0; 10 -12,-1; 11 -12,-2; 12 -12,-3; 13 -12,-4; 14 -12,-5; 15 -12,-6; 16 -12,-7; 17 -12,-8; 35 12,-8; 36 12,-7; 37 12,-6; 38 12,-5; 39 12,-4; 40 12,-3; 41 12,-2; 42 12,-1; 43 12,0; 44 12,1; 45 12,2; 46 12,3; 47 12,4; 48 12,5; 49 12,6; 50 12,7; 51 12,8 | smd 0.6 x 1.6: 18 -8,-12; 19 -7,-12; 20 -6,-12; 21 -5,-12; 22 -4,-12; 23 -3,-12; 24 -2,-12; 25 -1,-12; 26 0,-12; 27 1,-12; 28 2,-12; 29 3,-12; 30 4,-12; 31 5,-12; 32 6,-12; 33 7,-12; 34 8,-12; 52 8,12; 53 7,12; 54 6,12; 55 5,12; 56 4,12; 57 3,12; 58 2,12; 59 1,12; 60 0,12; 61 -1,12; 62 -2,12; 63 -3,12; 64 -4,12; 65 -5,12; 66 -6,12; 67 -7,12; 68 -8,12
SOT23-3 = smd 0.8 x 0.9: 1 -0.95,-1; 2 0.95,-1; 3 0,1.1
FIDUCIAL_1MM = smd 1 x 1: 1 0,0
USB-C = smd 0.3 x 0.7: A1 -3,4.715; A2 -2.5,4.715; A3 -2,4.715; A4 -1.5,4.715; A5 -1,4.715; A6 -0.5,4.715; A7 0.5,4.715; A8 1,4.715; A9 1.5,4.715; A10 2,4.715; A11 2.5,4.715; A12 3,4.715; B2 2.25,3.415; B3 1.75,3.415; B4 1.25,3.415; B5 0.75,3.415; B6 0.25,3.415; B7 -0.25,3.415; B8 -0.75,3.415; B9 -1.25,3.415; B10 -1.75,3.415; B11 -2.25,3.415 | smd 1 x 0.7: B1 3.1,3.415; B12 -3.1,3.415 | smd 1.1 x 2.1: P$24 -4.32,4.305; P$26 4.32,4.305 | smd 1.1 x 2.6: P$25 -4.32,-1.055; P$27 4.32,-1.055
HUM_SEN = smd 0.9 x 3: 1 -1.27,-5.335; 2 0,-5.335; 3 1.27,-5.335 | smd 2.794 x 2.519: 4 0,5.59
SOT223 = smd 1.219 x 2.235: 1 -2.311,-3.099; 2 0,-3.099; 3 2.311,-3.099 | smd 3.6 x 2.2: 4 0,3.099
0806 = smd 0.5 x 1.6: 1 -0.75,0; 2 0.75,0
EIA2917 = smd 2 x 3.1: 1 -2.45,0; 2 3.55,0
CONN = smd 2.05 x 0.76: 1 1.775,2.54; 2 -1.775,2.54; 3 1.775,1.27; 4 -1.775,1.27; 5 1.775,0; 6 -1.775,0; 7 1.775,-1.27; 8 -1.775,-1.27; 9 1.775,-2.54; 10 -1.775,-2.54
64QFN = smd 0.6 x 0.25: 1 -4.5,3.75; 2 -4.5,3.25; 3 -4.5,2.75; 4 -4.5,2.25; 5 -4.5,1.75; 6 -4.5,1.25; 7 -4.5,0.75; 8 -4.5,0.25; 9 -4.5,-0.25; 10 -4.5,-0.75; 11 -4.5,-1.25; 12 -4.5,-1.75; 13 -4.5,-2.25; 14 -4.5,-2.75; 15 -4.5,-3.25; 16 -4.5,-3.75; 33 4.5,-3.75; 34 4.5,-3.25; 35 4.5,-2.75; 36 4.5,-2.25; 37 4.5,-1.75; 38 4.5,-1.25; 39 4.5,-0.75; 40 4.5,-0.25; 41 4.5,0.25; 42 4.5,0.75; 43 4.5,1.25; 44 4.5,1.75; 45 4.5,2.25; 46 4.5,2.75; 47 4.5,3.25; 48 4.5,3.75 | smd 0.25 x 0.6: 17 -3.75,-4.5; 18 -3.25,-4.5; 19 -2.75,-4.5; 20 -2.25,-4.5; 21 -1.75,-4.5; 22 -1.25,-4.5; 23 -0.75,-4.5; 24 -0.25,-4.5; 25 0.25,-4.5; 26 0.75,-4.5; 27 1.25,-4.5; 28 1.75,-4.5; 29 2.25,-4.5; 30 2.75,-4.5; 31 3.25,-4.5; 32 3.75,-4.5; 49 3.75,4.5; 50 3.25,4.5; 51 2.75,4.5; 52 2.25,4.5; 53 1.75,4.5; 54 1.25,4.5; 55 0.75,4.5; 56 0.25,4.5; 57 -0.25,4.5; 58 -0.75,4.5; 59 -1.25,4.5; 60 -1.75,4.5; 61 -2.25,4.5; 62 -2.75,4.5; 63 -3.25,4.5; 64 -3.75,4.5 | smd 7.5 x 7.5: P$1 0,0
BT_NVC-MDCS42A = smd 3.5 x 0.8: P$1 -7,0; P$2 -7,-1.2; P$3 -7,-2.4; P$4 -7,-3.6; P$5 -7,-4.8; P$6 -7,-6; P$7 -7,-7.2; P$8 -7,-8.4; P$9 -7,-9.6; P$10 -7,-10.8; P$11 -7,-12; P$12 -7,-13.2; P$13 -7,-14.4; P$20 7,-14.4; P$21 7,-13.2; P$22 7,-12; P$23 7,-10.8; P$24 7,-9.6; P$25 7,-8.4; P$26 7,-7.2; P$27 7,-6; P$28 7,-4.8; P$29 7,-3.6; P$30 7,-2.4; P$31 7,-1.2; P$32 7,0 | smd 0.8 x 3.5: P$14 -2.9,-17.5; P$15 -1.7,-17.5; P$16 -0.5,-17.5; P$17 0.7,-17.5; P$18 1.9,-17.5; P$19 3.1,-17.5
C707_10M006_512_2 = smd 1.7 x 1.3: C1 -12.85,-3.915; C2 -12.85,-1.375; C3 -12.85,1.165; C5 12.85,-3.915; C6 12.85,-1.375; C7 12.85,1.165
U.FL = smd 2.2 x 1.05: 1 0,1.375; 2 0,-1.375 | smd 0.8 x 1: 3 1.525,0
ESP-12 = smd 2 x 1.2: 1 -7.5,4.5; 2 -7.5,2.5; 3 -7.5,0.5; 4 -7.5,-1.5; 5 -7.5,-3.5; 6 -7.5,-5.5; 7 -7.5,-7.5; 8 -7.5,-9.5; 9 7.5,-9.5; 10 7.5,-7.5; 11 7.5,-5.5; 12 7.5,-3.5; 13 7.5,-1.5; 14 7.5,0.5; 15 7.5,2.5; 16 7.5,4.5
CRYSTAL-3.2X2.5 = smd 1.4 x 1.2: 1 -1.1,-0.8; 2 1.1,-0.8; 3 1.1,0.8; 4 -1.1,0.8

### Placement (x,y rotation side)
C1  30.6,57.45 180 bottom
C2  32.23,10.82 180 top
C4  27.35,62.89 90 bottom
C5  30.65,59.69 180 bottom
C6  35.12,60.81 180 bottom
C7  41.37,51.05 270 bottom
C8  35.07,58.52 180 bottom
C9  67.28,33.68 90 bottom
C10  23.74,10.52 90 top
C11  25.42,10.52 270 top
C12  44.72,69.34 90 bottom
C13  23.08,19.2 90 top
C14  24.45,19.2 90 top
C15  26.74,19.2 90 top
C16  13.77,8.69 270 top
C17  13.79,12.19 90 top
C18  73.37,29.57 90 top
C19  47.01,11.43 180 top
C20  53.41,13.56 90 top
C21  59,9.8 90 top
C22  64.74,9.8 90 top
C23  62.35,9.8 90 top
C24  41.37,48.62 0 bottom
C25  41.37,47.09 0 bottom
C26  56.51,9.8 90 top
C27  41.37,45.57 0 bottom
CON_BAT  35.53,16.94 270 top
D1  60.39,2.58 0 top
D2  34.92,2.58 90 top
D3  21.25,19.2 270 top
D4  47.77,73.91 90 bottom
D5  47.77,69.34 90 bottom
D7  69.72,78.49 0 bottom
D8  51.28,13.56 270 top
D9  47.77,78.49 90 bottom
D11  38.93,37.95 0 bottom
D12  62.71,58.98 180 bottom
D13  63.32,10.52 0 bottom
D14  63.32,13.72 0 bottom
D15  50.06,40.84 270 bottom
D16  25.22,58.67 270 bottom
D17  63.32,7.47 0 bottom
IC1  77.34,28.85 0 top
J1  70.78,73.76 281.2 top
JP1  70.78,59.13 0 bottom
JP2  67.28,59.13 0 bottom
R1  64.23,55.47 0 bottom
R2  62.71,16.92 0 bottom
R3  53.56,57.61 0 bottom
R4  72,33.68 270 bottom
R5  69.56,33.68 90 bottom
R6  60.57,55.47 180 bottom
R7  53.56,55.47 180 bottom
R8  38.78,4.11 270 top
R9  50.51,4.11 270 top
R10  38.93,40.18 0 bottom
R11  65.75,3.96 0 top
R12  52.49,17.07 0 top
R13  52.49,18.75 180 top
R14  65.75,1.37 0 top
R15  53.41,4.11 90 top
R18  31.31,8.23 90 top
R19  37.71,10.82 0 top
R21  57.07,55.47 0 bottom
S1  77.49,33.68 260 bottom
S2  18.81,61.72 0 bottom
U1  34.92,8.23 270 top
U9  69.94,15.75 270 bottom
U$1  30.73,79.55 0 bottom
U$2  24.56,7.18 180 top
U$3  4.79,2.59 0 bottom
U$4  44.65,2.39 0 top
U$5  19.74,7.18 180 top
U$6  60.67,17.27 0 top
U$7  47.01,14.02 0 top
U$8  63.32,30.94 270 bottom
U$9  54.18,7.86 180 bottom
U$12  58.13,93.42 0 top
U$13  47.01,16.76 90 top
U$14  4.79,2.59 0 top
U$16  44.72,58.22 180 bottom
UBT  19.12,46.33 270 bottom
X1  59.51,75.44 90 bottom
X2  39.85,95.1 270 bottom
X3  63.42,45.62 90 bottom
Y1  30.85,63.04 0 bottom

### Tracks (layer width: path | path; a pad name or v marks a point on that pad's centre or on a via)
1.8V  (via drill 0.3)
  Top 0.305: v62.55,69.19 v59.66,69.19 | v55.54,67.82 v55.54,60.81 | v50.36,74.37 31.62,74.37 v28.87,71.63
  Bottom 0.305: D7.1 70.47,76.64 63.01,69.19 v62.55,69.19 | v59.66,69.19 56.91,69.19 v55.54,67.82 55.54,69.19 v50.36,74.37 | v55.54,60.81 55.59,60.85 X1.C1 | v28.87,71.63 27.73,70.48 U$1.29
3V3  (via drill 0.3)
  Top 0.356: C17.2 17.94,13.04 U$5.3 18.51,12.55 v18.51,14.63 | J1.VCC 71.65,66.9 62.86,66.9 v61.94,65.99 61.03,65.08 v61.03,56.69 61.03,46.48 v55.85,41.3 | v66.52,14.02 66.52,12.98 C22.A | v72.92,19.05 v75.51,19.05 | v78.25,21.95 76.12,21.95 v75.51,22.55 | v47.16,33.07 46.09,34.14 43.8,34.14 41.83,36.11 v41.83,40.08 35.88,46.02 v32.38,46.02
  Top 0.406: C23.2 62.9,11.2 C22.A 64.74,12.42 U$6.3
  Bottom 0.305: R3.1 56.22,55.65 R21.2
  Bottom 0.356: v18.51,14.63 19.42,15.54 56,15.54 58.9,18.44 62.71,18.44 63.92,19.66 v65.45,19.66 | v72.92,19.05 72.31,19.66 v65.45,19.66 | v78.25,21.95 78.25,23.16 75.96,25.45 71.7,25.45 68.8,28.35 68.8,29.87 67.3,31.37 67.3,32.83 | v75.51,19.05 v75.51,22.55 | v66.52,14.02 66.52,18.59 65.52,19.58 v65.45,19.66 | R21.2 56.22,56.91 56.91,57.61 56.91,64.62 58.29,65.99 v61.94,65.99 | R6.2 61.03,55.87 v61.03,56.69 | 67.3,32.83 R5.1 R4.2 | 67.3,32.83 C9.1 63.87,32.83 U$8.1 63.31,33.07 62.8,33.59 62.8,33.83 56.62,33.83 | R10.1 arc90 39.88,40.08 v41.83,40.08 | v32.38,46.02 32.38,53.12 UBT.P$12 32.32,56.59 C1.2 | v47.16,33.07 47.92,33.83 56.62,33.83 | 56.62,33.83 55.71,34.75 55.69,34.75 53.92,36.53 53.92,38.1 | 53.92,38.1 X3.8 | v55.85,41.3 53.92,39.37 53.92,38.1
  Bottom 0.406: R1.2 R6.2 | R2.1 63.92,17.29 63.92,17.98 65.52,19.58
5V  (via drill 0.3)
  Top 0.356: 53.11,14.26 C20.2 53.41,17 R12.2 | 53.11,14.26 D8.P$1 | C11.2 25.42,8.27 U$2.1 26.43,7.25 v26.43,5.33 | 59.62,2.13 D1.1 56.59,2.15 55.85,2.9 55.85,5.18 57.22,6.55 58.44,6.55 v58.9,7.01 59.96,7.01 60.57,7.62 60.57,11.28 v59.66,12.19 | v55.24,17.07 v55.24,14.17 55.45,14.26 53.11,14.26 | IC1.14 74.74,31.78 C18.2 59.42,30.42 v58.9,30.94 54.17,30.94 v50.06,35.05 | v45.79,24.84 45.79,21.34 v46.4,20.73 | v41.83,64.47 43.81,64.47 45.79,62.48 45.79,54.41 47.01,53.19 v47.01,52.27 46.09,51.36 40.45,51.36 v39.24,52.58
  Bottom 0.305: U$16.52 46.97,52.27 v47.01,52.27 | U$16.21 42.97,63.93 42.44,64.47 v41.83,64.47
  Bottom 0.356: 26.42,5.32 v26.43,5.33 28.72,3.05 50.14,3.05 U$9.2 U$9.1 57.2,5.32 v58.9,7.01 | v55.24,17.07 49.29,17.07 46.4,19.96 v46.4,20.73 | v58.9,30.94 52.8,24.84 v45.79,24.84 | v59.66,12.19 57.52,12.19 55.54,14.17 v55.24,14.17 | C27.2 C25.2 C24.2 39.24,50.05 v39.24,52.58 40.37,53.72 U$16.64 | v50.06,35.05 48.53,36.58 48.53,39.78 46.7,41.6 46.7,51.97 v47.01,52.27
+  (via drill 0.3)
  Top 0.305: U$4.A6 44.15,8.35 v44.11,8.38 | v38.78,6.4 R8.1 | U$4.B6 44.9,4.7 v45.33,4.27
  Bottom 0.305: v38.78,6.4 38.78,7.16 40.3,8.69 43.81,8.69 v44.11,8.38 44.11,5.49 v45.33,4.27
-
  Top 0.254: U$4.A7 45.12,7.1 44.42,6.4 44.42,5.82 U$4.B7
  Top 0.305: R9.1 50.51,7.47 48.84,9.14 46.55,9.14 45.13,7.72 45.13,7.12 U$4.A7
BT_RX
  Bottom 0.305: UBT.P$20 34.9,37.95 37.6,37.95 | 37.6,37.95 D11.A | R10.2 37.6,39.7 37.6,37.95
BT_RX_5V  (via drill 0.3)
  Top 0.305: v42.89,43.59 43.96,44.65 v49.45,44.65
  Bottom 0.305: D11.C 41.98,37.95 42.89,38.86 v42.89,43.59 | 49.29,54.4 U$16.48 49.75,53.94 49.75,44.96 v49.45,44.65
BT_TX  (via drill 0.3)
  Top 0.305: v36.49,25.6 44.57,25.6 v46.86,27.89 | IC1.2 76.07,25.96 76.07,27.1 75.74,27.43 68.95,27.43 v66.97,29.41 | v31.16,33.22 31.01,33.38 v31.01,36.27 | v59.2,27.89 57.98,29.11 v53.87,29.11
  Bottom 0.305: v36.49,25.6 33.9,28.19 33.9,30.48 v31.16,33.22 | UBT.P$21 32.32,36.82 31.77,36.27 v31.01,36.27 | v66.97,29.41 60.72,29.41 v59.2,27.89 | v46.86,27.89 52.65,27.89 v53.87,29.11
BT_TX_5V  (via drill 0.3)
  Top 0.305: IC1.3 76.69,24.95 76.42,24.69 67.28,24.69 65.75,26.21 v57.22,26.21 | 43.5,32.77 42.74,32.77 35.88,39.62 35.88,41.45 32.83,44.5 v32.38,44.5 | 43.5,32.77 43.66,32.77 | v27.35,49.38 27.35,57.45 29.48,59.59 36.04,59.59 v37.56,61.11 | 43.5,32.77 44.57,32.77 52.95,24.38 v54.78,24.38
  Bottom 0.305: v57.22,26.21 55.39,24.38 v54.78,24.38 | v32.38,44.5 29.48,44.5 27.35,46.63 v27.35,49.38 | v37.56,61.11 37.91,61.47 U$16.15
BTM_CONN  (via drill 0.3)
  Top 0.305: v64.53,23.62 64.99,23.16 73.53,23.16 76.73,19.96 76.73,11.58 75.66,10.52 75.66,7.62 72,3.96 R11.2
  Bottom 0.305: v64.53,23.62 64.08,23.16 43.66,23.16 41.28,25.54 41.28,30.85 44.47,34.04 U$16.57
BTM_RST
  Bottom 0.305: UBT.P$6 25.21,53.43 D16.A
BTM_RST_5V  (via drill 0.35)
  Top 0.305: v48.38,47.4 48.23,47.24 42.89,47.24 v38.32,51.82 | v36.34,51.82 32.99,51.82 v31.31,50.14 | v23.54,50.14 22.78,50.9 22.78,58.98 v24,60.2
  Bottom 0.305: U$16.49 48.47,50.81 48.99,50.29 48.99,48.01 v48.38,47.4 | v38.32,51.82 v36.34,51.82 | v31.31,50.14 v23.54,50.14 | v24,60.2 24.96,60.2 D16.C
D+  (via drill 0.3)
  Top 0.305: R8.2 38.78,2.29 37.71,1.22 31.46,1.22 29.63,3.05 29.63,11.89 v24.61,16.92 | v34.82,56.24 33.9,56.24 30.09,52.43 30.09,32.31 v28.11,30.33
  Bottom 0.305: v24.61,16.92 24.61,26.82 v28.11,30.33 | U$16.5 35.05,56.47 v34.82,56.24
D-  (via drill 0.3)
  Top 0.305: v44.57,27.58 44.57,29.57 43.81,30.33 v38.47,30.33 33.6,35.2 v33.6,42.22 | v44.42,16.92 v44.42,10.21 | v47.77,4.27 48.77,3.27 R9.2 | v44.72,20.73 44.72,23.93 v44.26,24.38
  Bottom 0.305: v44.42,10.21 44.42,10.06 45.64,8.84 45.64,6.4 v47.77,4.27 | v44.42,16.92 44.72,17.22 v44.72,20.73 | v44.26,24.38 44.57,24.69 v44.57,27.58 | v33.6,42.22 33.6,49.68 35.27,51.36 35.27,54.71 36.53,55.97 U$16.4
ESP_RST  (via drill 0.3)
  Top 0.305: v50.06,37.8 54.32,37.8 57.52,41 v61.94,41
  Bottom 0.305: 71.9,34.53 R4.1 | D15.A v50.06,37.8 | X3.4 61.94,38.15 v61.94,41 67.43,41 68.14,40.29 68.14,38.34 67.97,38.17 | 67.97,38.17 X3.1 67.89,38.09 | R4.1 72,34.9 | R4.1 70.87,35.66 69.56,35.66 67.97,37.26 67.97,38.17 | 67.89,38.09 | 67.89,37.48 67.89,38.09
ESP_RST_5V  (via drill 0.3)
  Top 0.305: v48.23,49.53 49.6,49.53 v50.51,48.62
  Bottom 0.305: D15.C 50.51,42.57 v50.51,48.62 | U$16.50 47.97,49.78 v48.23,49.53
ESP_RX
  Bottom 0.305: JP2.2 67.28,55.17 65.92,53.81 X3.15 | 66.06,53.34 66.06,52.99 65.93,53.12 X3.15 | X3.15 65.92,54.64 R1.1
ESP_RX_5V  (via drill 0.3)
  Top 0.305: v58.29,58.98 56.15,58.98 v55.69,59.44
  Bottom 0.305: D12.C v58.29,58.98 | U$16.38 55.66,59.47 v55.69,59.44
ESP_RXI
  Bottom 0.305: 64.13,59.13 D12.A 64.13,59.13 | JP2.3 64.13,59.13
ESP_TX
  Bottom 0.305: 70.78,55.64 70.7,55.55 | 70.7,55.55 70.78,55.64 | JP1.2 70.78,55.64 | 70.7,55.55 68.27,53.12 X3.16
ESP_TX_5V  (via drill 0.3)
  Top 0.305: IC1.6 78.66,25.91 78.66,25.35 77.23,23.93 66.52,23.93 65.75,24.69 63.01,24.69 61.64,23.32 56.76,23.32 54.78,21.34 50.97,21.34 49.29,23.01 49.29,26.82 44.42,31.7 40.61,31.7 v37.1,35.2 | v25.37,34.9 25.37,58.52 27.65,60.81 35.12,60.81 36.49,62.18 v36.8,62.18
  Bottom 0.305: v37.1,35.2 36.8,34.9 v25.37,34.9 | v36.8,62.18 38.47,62.18 39.08,62.79 40.9,62.79 U$16.17
ESP_TXO  (via drill 0.3)
  Top 0.305: v68.8,56.08 65.45,52.73 v65.45,50.9 | v63.77,42.67 63.77,38.81 v70.93,31.65 | v77.34,29.57 77.99,28.92 IC1.5
  Bottom 0.305: v63.77,42.67 64.23,43.13 64.23,49.68 v65.45,50.9 | v70.93,31.65 72.25,30.33 76.57,30.33 v77.34,29.57 | 69.64,56.92 v68.8,56.08 | 69.64,56.92 69.74,57.02 | JP1.3 69.97,57.25 69.64,56.92
FTDI_RX  (via drill 0.3)
  Top 0.305: v69.87,63.86 68.65,63.86 v66.67,65.84
  Bottom 0.305: J1.RXI 66.67,66.66 v66.67,65.84 | v69.87,63.86 71.6,62.13 JP1.1
FTDI_TX
  Bottom 0.305: J1.TXO 68.09,65.1 JP2.1
GND  (via drill 0.3, 0.35)
  Top 0.305: U$4.A1 41.65,5.9 U$4.B12 | U$4.B1 47.65,5.9 U$4.A12 47.65,8.2 47.62,8.23 v47.01,8.23
  Bottom 0.305: U$16.6 43.47,56.97 U$16.P$1 | U$16.63 41.47,54.97 U$16.P$1 | U$16.53 46.47,56.47 U$16.P$1 | U$16.22 43.47,59.47 U$16.P$1 | S1.P1 76.79,34.54 S1.P2
  other vias: 32.53,6.25 13.18,1.98 44.11,4.27 47.01,16.76 29.94,13.56 48.99,14.02 53.71,1.68 79.01,2.59 82.52,1.83 84.19,4.42 83.13,13.11 9.37,29.26 8.3,25.6 6.93,21.64 8.15,16.61 4.64,13.72 2.81,3.35 7.99,1.83 39.39,72.09 22.17,76.66 21.86,84.89 25.37,87.93 31.01,87.17 38.63,85.04 47.01,86.26 46.09,92.35 49.45,94.79 54.78,93.73 61.18,92.96 25.67,93.73 32.84,95.1 50.97,86.72 49.6,83.36 54.93,83.82 61.49,83.97 57.83,81.69 60.11,77.27 66.36,69.49 64.99,82.45 66.52,90.07 34.51,89 63.62,5.79 55.09,18.59 75.66,2.9 72,1.83 70.63,5.79 67.43,5.18 82.21,17.07 69.11,21.03 41.67,14.02 28.11,6.86 27.96,10.36 23.23,3.51 25.37,3.35 24.3,1.52 15.77,5.79 9.82,13.87 13.33,19.66 12.26,23.62 21.71,24.69 27.81,24.69 30.24,22.86 9.37,33.83 13.02,31.55 17.44,32.77 14.24,35.51 9.98,37.49 22.78,33.22 26.59,32 23.54,30.63 16.99,36.88 35.58,30.33 34.36,25.45 22.01,46.94 22.01,44.81 21.71,71.78 40.46,69.49 19.73,90.83 62.1,81.38 51.58,1.52 44.72,58.22 49.9,65.38 51.73,61.42 52.34,53.04 57.22,51.05 57.52,48.01 67.73,50.14 68.5,47.85 63.01,62.79 69.56,62.33 34.51,71.17 17.29,57 13.79,56.54 14.55,60.35 14.39,64.47 16.68,66.14 21.71,57.76 21.41,49.53 24,48.62 23.84,46.02 24,43.28 21.1,42.67 34.05,32.77 37.86,23.93 57.52,19.2 66.82,21.49 68.5,25.91 59.35,32.31 66.97,27.43 73.68,26.37 76.88,27.58 80.38,30.94 74.29,58.37 72.15,56.24 74.59,55.17 55.85,75.13 36.95,76.96 68.34,86.11 44.72,60.2 44.72,55.93 46.7,58.22 43.05,58.22 50.67,62.48 16.07,69.8 61.33,42.67 73.98,32.46 77.79,34.14 42.89,50.29 38.78,53.95 42.89,52.43 54.17,7.16
  pour Top (rank 6): -4.6,-2.84 -4.6,99.72 90.29,99.72 90.29,-2.84
  pour Bottom (rank 6): -5.37,-3.45 -5.37,100.48 91.2,100.48 91.2,-3.45
HUM_SEN  (via drill 0.3)
  Top 0.305: 19.74,11.58 19.74,11.45 | 19.74,11.58 U$5.2 19.74,16.29 17.29,18.75 v17.29,27.13 | C16.1 13.83,9.6 18.81,9.6 19.74,10.53 19.74,11.58 | v23.23,27.13 v42.59,27.13 | v46.09,39.17 46.09,35.97 v45.94,35.81
  Bottom 0.305: v17.29,27.13 v23.23,27.13 | v45.94,35.81 45.94,33.98 42.13,30.18 42.13,27.66 42.59,27.21 v42.59,27.13 | v46.09,39.17 45.47,39.79 U$16.55
N$1
  Bottom 0.305: 69.56,34.9 R5.2 67.97,36.12 66.82,36.12 65.92,37.02 X3.2
N$2  (via drill 0.3)
  Top 0.305: v22.93,61.57 24.45,63.09 37.86,63.09 v38.32,63.55
  Bottom 0.305: S2.P4 S2.P3 22.08,60.72 v22.93,61.57 | U$16.20 42.47,63.36 42.28,63.55 v38.32,63.55
N$3
  Bottom 0.305: U$16.7 36.97,57.47 C8.2
N$4
  Bottom 0.305: U$16.62 41.97,52.51 C7.1
N$6
  Top 0.305: D2.C 31.31,5.31 R18.1
N$7
  Bottom 0.305: R21.1 X3.11
N$8
  Top 0.305: U1.1 31.87,9.18 R18.2
N$9
  cutout Top: 18.05,53.19 18.05,39.47 7.54,39.47 7.54,53.19
N$11  (via drill 0.35)
  Top 0.305: v67.28,49.07 66.67,49.68 64.99,49.68 63.77,50.9 63.77,56.08 v63.16,56.69 | v58.9,57.61 55.85,57.61 v55.69,57.76
  Bottom 0.305: U$16.43 49.25,57 51.28,57 51.88,57.61 52.49,57.61 | 52.49,57.61 R3.2 | S1.P4 78.76,34.89 S1.P3 78.15,35.45 77.34,36.27 70.02,36.27 69.11,37.19 69.11,43.89 67.28,45.72 v67.28,49.07 | v63.16,56.69 62.25,57.61 v58.9,57.61 | v55.69,57.76 55.69,57.91 54.93,58.67 52.95,58.67 52.49,58.22 52.49,57.61
N$12
  Bottom 0.305: R7.2 55.92,53.97 X3.10
N$13
  Top 0.305: R11.1 62.1,3.96 D1.4
N$14
  Bottom 0.406: U$1.66 36.73,92.59 37.41,93.27 39.54,93.27 X2.3
N$15
  Bottom 0.305: U$1.17 43.36,71.55 C12.2
N$16
  Top 0.305: R14.1 61.93,1.37 D1.3
N$17
  Top 0.305: R12.1 R13.2 51.49,18.9 49.49,18.9 U$13.3
N$18
  Top 0.305: U1.5 36.86,9.82 R19.1
N$19
  cutout Bottom: 7.54,53.19 7.54,39.47 18.05,39.47 18.05,53.19
N$20
  Bottom 0.305: R6.1 59.92,55.28 X3.12
N$21
  cutout Bottom: 69.72,53.64 69.72,37.49 80.08,37.49 80.08,53.64
N$22
  cutout Top: 69.72,53.64 69.72,37.49 80.08,37.49 80.08,53.64
N$23  (via drill 0.35)
  Top 0.305: R15.1 53.47,3.2 v54.63,3.2 | v57.07,3.2 59.45,3.2 D1.2
  Bottom 0.305: v54.63,3.2 v57.07,3.2
N$24
  Top 0.305: U$13.1 48.31,14.57 U$7.2 49.87,11.91 D8.P$2
N$26  (via drill 0.3)
  Top 0.305: v44.26,66.45 38.93,66.45 v36.8,64.31
  Bottom 0.305: C5.2 31.95,60.14 Y1.1 34.73,62.24 v36.8,64.31 | U$16.24 44.43,62.76 44.43,66.28 v44.26,66.45
N$27
  Bottom 0.305: C4.2 27.45,63.84 Y1.3 29.75,64.89 30.4,65.53 42.74,65.53 43.96,64.31 U$16.23
NOT_CONN  (via drill 0.3)
  Top 0.305: v39.74,13.66 v39.74,17.88 | v50.36,8.99 53.41,5.94 R15.2
  Bottom 0.305: v39.74,13.66 41.37,12.04 47.31,12.04 v50.36,8.99 | v39.74,17.88 39.74,33.88 43.97,38.11 U$16.58
PT_RST
  Bottom 0.305: D17.A 61.66,7.86 U$9.5
PT_RST_5V  (via drill 0.3)
  Top 0.305: v55.54,31.85 55.54,32.92 v53.71,34.75 | v53.87,22.25 v50.36,25.76
  Bottom 0.305: D17.C 70.48,7.47 72.76,9.75 72.76,12.04 74.29,13.56 74.29,22.55 73.22,23.62 66.36,23.62 64.84,22.1 54.02,22.1 v53.87,22.25 | 55.39,32 v55.54,31.85 55.54,29.11 52.19,25.76 v50.36,25.76 | v53.71,34.75 51.43,37.03 51.43,55.32 50.28,56.47 U$16.44
PT_RX
  Bottom 0.305: D13.A 60.65,9.12 U$9.7 54.8,9.12 54.32,9.6 54.32,10.82 54.93,11.43 55.39,11.43 56,12.04 56,12.8 55.39,13.41 54.63,13.41 54.17,13.87 54.17,14.63 54.48,14.94 56.46,14.94 58.44,16.92 R2.2
PT_RX_5V  (via drill 0.3, 0.35)
  Top 0.305: v74.74,9.6 v70.93,9.6 | v69.41,31.55 65.91,31.55 61.64,35.81 50.51,35.81 48.53,37.8 v48.53,43.13 | v47.47,48.62 47.47,50.9 47.92,51.36 47.92,63.4 v47.62,63.7
  Bottom 0.305: v70.93,9.6 69.72,8.38 65.3,8.38 64.53,9.14 64.53,10.46 D13.C | v69.41,31.55 69.41,30.63 71.09,28.96 75.81,28.96 76.12,28.65 77.79,28.65 79.16,27.28 79.16,12.65 76.12,9.6 v74.74,9.6 | 48.47,43.19 v48.53,43.13 47.47,44.2 v47.47,48.62 | U$16.28 46.47,63.47 46.7,63.7 v47.62,63.7
PT_TX  (via drill 0.3)
  Top 0.305: IC1.9 78.64,29.48 80.23,27.89 80.23,15.7 v78.25,13.72 | v70.33,11.43 v74.74,11.43
  Bottom 0.305: U$9.9 59.69,10.39 61.49,12.19 67.28,12.19 67.58,11.89 69.87,11.89 v70.33,11.43 | v74.74,11.43 75.96,11.43 v78.25,13.72
PT_TX_5V  (via drill 0.3, 0.35)
  Top 0.305: IC1.8 79.62,32.12 79.62,34.75 79.01,35.36 71.09,35.36 68.5,37.95 68.5,46.02 65.75,48.77 64.08,48.77 v63.16,49.68 | v54.63,49.68 50.36,49.68 48.68,51.36 48.68,64.16 47.77,65.08 v47.62,65.08
  Bottom 0.305: v63.16,49.68 v54.63,49.68 | v47.62,65.08 47.01,65.08 45.97,64.04 U$16.27
SIM_RST
  Bottom 0.305: U$1.16 44.86,72.55 46.7,70.71 47.67,70.71 D5.A
SIM_RST_5V
  Bottom 0.305: U$16.25 44.97,65.02 47.77,67.82 D5.C
SIM_RX
  Bottom 0.305: U$1.15 42.78,73.61 44.57,73.61 46.09,75.13 47.72,75.13 D4.A
SIM_RX_5V
  Bottom 0.305: U$16.26 45.47,64.76 47.16,66.45 48.38,66.45 49.14,67.21 49.14,72.08 48.68,72.54 47.87,72.54 D4.C
SIM_TX  (via drill 0.3)
  Top 0.305: IC1.12 76.69,32.65 75.96,33.38 71.24,33.38 66.67,37.95 66.67,43.28 65.6,44.35 v62.25,44.35 | v45.48,76.66 47.01,78.18 53.59,78.18 | 53.59,78.18 v53.87,78.18 | 53.59,78.18 53.87,77.9 53.87,55.17 56,53.03 v56,44.35
  Bottom 0.305: 43.38,74.55 U$1.14 44.14,74.55 45.48,75.89 v45.48,76.66 | v56,44.35 v62.25,44.35
SIM_TX_5V  (via drill 0.3)
  Top 0.305: IC1.11 77.34,33.22 75.96,34.59 70.93,34.59 67.43,38.1 67.43,43.74 64.84,46.33 v63.16,46.33 | v54.78,46.33 42.28,46.33 37.41,51.21 37.41,57.15 38.32,58.06 38.32,58.98 38.17,59.13 v38.17,60.2
  Bottom 0.305: v63.16,46.33 v54.78,46.33 | U$16.13 38.44,60.47 v38.17,60.2
SIMCLK  (via drill 0.3)
  Top 0.305: v39.54,79.7 v51.58,79.7 | v60.72,67.67 59.81,66.75 v59.81,60.81
  Bottom 0.305: v60.72,67.67 60.72,74.68 v65.45,79.4 | 60.72,62.53 X1.C3 59.81,61.73 v59.81,60.81 | v39.54,79.7 32.07,79.7 25.73,73.36 U$1.31 | D7.4 68.95,79.4 v65.45,79.4 | v51.58,79.7 65.14,79.7 v65.45,79.4
SIMDATA  (via drill 0.3)
  Top 0.305: v32.53,78.49 32.53,83.21 39.54,90.22 v60.72,90.22
  Bottom 0.305: D7.5 69.72,81.53 63.01,88.24 61.18,88.24 | 61.18,88.24 60.72,88.24 X1.C7 | v60.72,90.22 60.72,88.7 61.18,88.24 | v32.53,78.49 26.73,72.68 U$1.30
SIMRST  (via drill 0.3)
  Top 0.305: v58.13,60.81 58.13,70.56 59.35,71.78 v61.94,71.78 52.49,81.23 v39.69,81.23
  Bottom 0.305: D7.3 67.75,77.59 v61.94,71.78 | v58.13,60.81 X1.C2 | v39.69,81.23 31.77,81.23 24.73,74.19 U$1.32
SLEEP_PT  (via drill 0.3)
  Top 0.279: v55.09,12.65 55.24,12.65
  Top 0.305: 55.24,12.65 v56.91,14.33
  Bottom 0.305: U$9.10 54.66,12.65 v55.09,12.65 55.24,12.65 | D14.A 61.44,14.33 v56.91,14.33
SLEEP_PT_5V  (via drill 0.3)
  Top 0.305: v65.3,17.98 64.08,19.2 v64.08,20.88 | v48.07,21.79 47.62,22.25 v47.62,26.06 | v56.91,32.77 57.37,33.22 v57.37,34.85 | v57.37,36.58 57.37,38.56 v58.9,40.08 | v53.87,51.05 v50.51,51.05
  Bottom 0.305: D14.C 65.3,14.43 v65.3,17.98 | 48.07,21.72 48.07,21.64 | 48.07,21.72 v48.07,21.79 | v64.08,20.88 48.92,20.88 48.07,21.72 | v47.62,26.06 47.16,26.06 45.79,27.43 45.79,28.8 47.01,30.02 51.12,30.02 53.87,32.77 v56.91,32.77 | v57.37,34.85 v57.37,36.58 | v58.9,40.08 58.9,42.37 58.13,43.13 55.54,43.13 53.87,44.81 v53.87,51.05 | U$16.45 49.87,55.97 50.51,55.32 v50.51,51.05
SLEEP_SIM
  Bottom 0.305: U$1.9 47.57,79.55 D9.A
SLEEP_SIM_5V  (via drill 0.35)
  Top 0.305: v39.39,59.44 39.39,64.31 40.45,65.38 45.48,65.38 46.4,66.29 48.99,66.29 50.36,67.67 v50.36,70.26
  Bottom 0.305: D9.C 47.82,77.27 48.68,77.27 49.45,76.5 49.45,73.3 50.36,72.39 v50.36,70.26 | U$16.11 39.42,59.47 v39.39,59.44
TEMP  (via drill 0.3)
  Top 0.305: U$2.2 23.74,8.31 C10.1 23.68,9.6 v20.8,9.6 | v43.2,28.65 v21.25,28.65 | v47.31,39.17 47.31,34.75 48.53,33.53 48.53,31.85 v48.38,31.7
  Bottom 0.305: 15.65,14.74 v20.8,9.6 | 15.65,14.74 15.61,14.78 | v43.2,28.65 43.2,29.57 45.33,31.7 v48.38,31.7 | U$16.54 45.97,40.66 47.31,39.32 v47.31,39.17 | v21.25,28.65 17.29,28.65 15.61,26.98 15.61,14.78 | 15.61,14.78 15.65,14.74
VBAT
  Top 0.356: U9.LS1 64.54,22.4 60.62,22.4 60.42,22.4 | CON_BAT.2 36.28,15.94 39.69,19.36 47.31,19.36
  Top 0.406: U1.3 34.32,7.28 34.97,7.92 34.97,10.06 34.21,10.82 C2.1 | CON_BAT.2 33.53,14.24 33.53,11.28 C2.1 | 33.53,10.82 C2.1 | U9.LS2 U9.LS1 | 47.31,19.36 48.07,20.12 56.15,20.12 58.44,22.4 60.62,22.4
VBAT-A  (via drill 0.3)
  Top 0.406: C19.2 46.16,13.92 U$7.1 46.26,15.26 U$13.5 U$13.4 45.13,18.29 v41.22,18.29 | 46.16,11.52 C19.2 | C19.2 46.16,10.76 46.86,10.06 55.36,10.06 C26.A | 58.36,13.97 U$6.1 | 58.36,13.97 58.36,13.06 C26.A | C21.2 58.45,11.2 C26.A | U9.C2 U9.C1 67.68,16.76 58.74,16.76 58.44,16.46 58.44,14.05 58.36,13.97 | 26.5,18.04 26.19,18.35 C14.1 C13.1 21.98,18.35 D3.A 19.58,19.3 19.58,64.62 24.61,69.65 24.61,79.7 v27.5,82.6 | 26.5,18.04 C15.1 | v31.31,20.57 30.24,20.57 27.71,18.04 26.5,18.04
  Bottom 0.406: U$1.4 U$1.5 U$1.6 35.78,82.55 v35.73,82.6 v27.5,82.6 | v41.22,18.29 41.22,17.37 40.45,16.61 35.43,16.61 31.46,20.57 v31.31,20.57
VUSB  (via drill 0.3)
  Top 0.356: U$4.A4 43.15,8.13
  Top 0.406: D2.A 35.87,2.58 37.41,4.12 37.41,6.09 U1.4 37.22,7.28 40.3,10.36 v41.37,10.36 43.15,8.59 | v38.32,22.55 41.22,22.55 42.44,21.34 v42.44,20.88 | 43.15,8.59 43.15,16.51 v42.44,17.22 | 43.15,8.13 43.15,8.59 | 37.41,58.5 v37.41,58.52 | v28.87,33.68 28.87,56.54 30.84,58.5 37.41,58.5 | v36.49,54.41 36.49,57.59 37.41,58.5
  Bottom 0.305: U$16.8 38.88,57.97 38.47,58.37 | U$16.3 38.77,55.47 37.71,54.41 v36.49,54.41
  Bottom 0.406: v42.44,20.88 v42.44,17.22 | v28.87,33.68 30.09,32.46 30.09,27.13 34.66,22.55 v38.32,22.55 | C6.2 36.18,60.6 36.23,60.66 37.41,59.48 v37.41,58.52 38.32,58.52 38.47,58.37
WIFI_CONN  (via drill 0.3, 0.35)
  Top 0.305: v59.66,24.54 56.3,24.54 52.65,28.19 52.65,31.09 v48.38,35.36 | v69.87,1.37 R14.2
  Bottom 0.305: v59.66,24.54 74.9,24.54 76.88,22.55 76.88,14.94 73.68,11.73 73.68,5.18 v69.87,1.37 | U$16.56 44.97,38.76 v48.38,35.36

### Text on the board
tPlace: Airbeam 2.4 | RXI | TXO | VCC | D8 | CHRG | CONN
bPlace: GSM | RXI | TXO | RST | VCC | R3 | R1 | BOOT PROG | U9 | R2
Measures: 97.38mm | 87.02mm
Document: Changes made for v1.4: / -Enlarged pads for humidity sensor / -Added resistors for RGB led / -Removed bottom pads from ESP / -Modified hole size for light pipes / -Added fiducial on bottom
tDocu: Battery | HUM+TEMP | USB | LED | LED
bDocu: Plantower | Button